# Altium project 100275_NOTECARRIER-F.PrjPCB
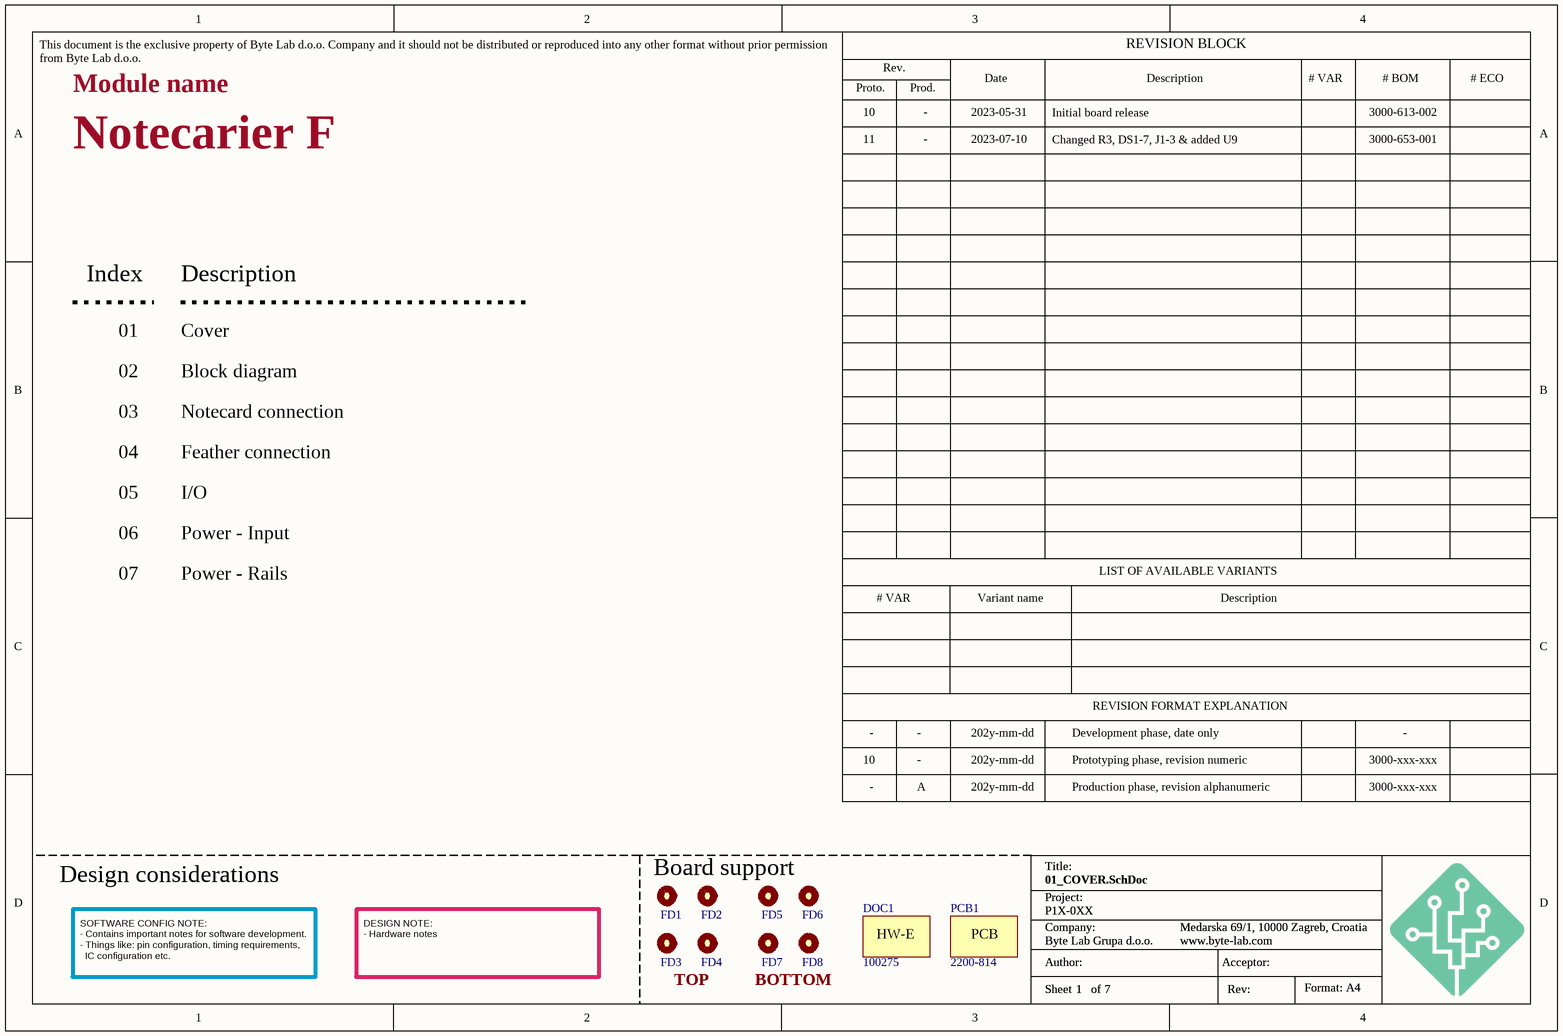
[diagram p0: 01_COVER.SchDoc]
Template_Rev: 25; Sch_Author: M. Hamin; Sch_Acceptor: T. Zvonc; PCBA_BOM_Num: 3000-613-002; PCB_Num: 2200-814; PCB_Author: M. Hamin; PCB_Acceptor: T. Zvonc; Module_Name: Notecarier F; HW_E_Doc_Rev: 11; HW_E_Doc_Num: 100275; FW_Doc_Num: 1xxxxx
7 sheets, 108 parts. Net scope: global (net labels, ports and power ports of the same name join across sheets).
Board files: Notecarier-F.PcbDoc, Notecarier-F_Panel.PcbDoc
Sheets:
  01_COVER.SchDoc
  02_BLOCK-DIAGRAM.SchDoc
  03_NOTECARD-CONNECTION.SchDoc
  04_FEATHER-CONNECTION.SchDoc
  05_IO.SchDoc
  06_POWER-INPUT.SchDoc
  07_POWER-RAILS.SchDoc

## Sheet 01_COVER.SchDoc
size A4; CheckedBy: Inženjer 2; Author: M. Hamin; CompanyName: Byte Lab Grupa d.o.o.; Engineer: Matija Puskar; Organization: Byte Lab Grupa d.o.o.; Address1: Medarska 69/1, 10000 Zagreb, Croatia; DocumentNumber: 1; Revision: 11; SheetNumber: 1; SheetTotal: 7; Web: www.byte-lab.com; Acceptor: T. Zvonc; ProjectName: P1X-0XX

### Parts
DOC1  BL Part Number: 100275  (hidden comment: Electronic design doc number)  (mechanical)
FD1  Fiducial mark  [Fiducial mark 1mm]  (value not drawn)  (no BOM)
FD2  Fiducial mark  [Fiducial mark 1mm]  (value not drawn)  (no BOM)
FD3  Fiducial mark  [Fiducial mark 1mm]  (value not drawn)  (no BOM)
FD4  Fiducial mark  [Fiducial mark 1mm]  (value not drawn)  (no BOM)
FD5  Fiducial mark  [Fiducial mark 1mm]  (value not drawn)  (no BOM)
FD6  Fiducial mark  [Fiducial mark 1mm]  (value not drawn)  (no BOM)
FD7  Fiducial mark  [Fiducial mark 1mm]  (value not drawn)  (no BOM)
FD8  Fiducial mark  [Fiducial mark 1mm]  (value not drawn)  (no BOM)
PCB1  BL Part Number: 2200-814  (hidden comment: PCB Part Number)  (mechanical)

### Nets

Not connected (* = marked no-connect by the designer): FD1 1; FD2 1; FD3 1; FD4 1; FD5 1; FD6 1; FD7 1; FD8 1

### Notes on the sheet
- Module name
- 10
- -
- 2023-05-31
- 3000-613-002
- 11
- 2023-07-10
- Initial board release
- Changed R3, DS1-7, J1-3 & added U9
- 3000-653-001
- Index
- Description
- 01
- 02
- Cover
- Block diagram
- 03
- Notecard connection
- 04
- 05
- Feather connection
- I/O
- 06
- 07
- Power - Input
- Power - Rails
- Design considerations
- Board support
- SOFTWARE CONFIG NOTE:
  - Contains important notes for software development.
  - Things like: pin configuration, timing requirements,
  IC configuration etc.
- DESIGN NOTE:
  - Hardware notes
- TOP
- BOTTOM
- This document is the exclusive property of Byte Lab d.o.o. Company and it should not be distributed or reproduced into any other format without prior permission
- from Byte Lab d.o.o.
- Proto.
- Rev.
- Prod.
- Date
- REVISION BLOCK
- # VAR
- # BOM
- # ECO
- LIST OF AVAILABLE VARIANTS
- Variant name
- REVISION FORMAT EXPLANATION
- A
- 202y-mm-dd
- Development phase, date only
- Prototyping phase, revision numeric
- Production phase, revision alphanumeric
- 3000-xxx-xxx
- Project:
- Title:
- Author:
- Company:
- Acceptor:
- Format: A4
- Sheet
- of
- Rev:
- (in symbol PN_HW-E) HW-E
- (in symbol PN_PCB) PCB

### Library data of the parts
DOC1 = PN_HW-E: Manufacturer: Byte Lab; Checked_By: Zvonc; Drawn_By: Dodig; Manufacturer Part Number: *; DateModified: *; Note: *
FD1-FD8 = Fiducial mark: Drawn_By: Puskar; Checked_By: Dodig; BL Part Number: N/A; Note: *; Manufacturer: N/A; Manufacturer Part Number: N/A; DateModified: 17-06-2013
PCB1 = PN_PCB: Manufacturer: Byte Lab; Checked_By: Zvonc; Drawn_By: Dodig; Manufacturer Part Number: *; DateModified: *; Note: *

## Sheet 02_BLOCK-DIAGRAM.SchDoc
size A4; CheckedBy: Inženjer 2; Author: M. Hamin; CompanyName: Byte Lab Grupa d.o.o.; Engineer: Matija Puskar; Organization: Byte Lab Grupa d.o.o.; Address1: Medarska 69/1, 10000 Zagreb, Croatia; DocumentNumber: 1; Revision: 11; SheetNumber: 2; SheetTotal: 7; Web: www.byte-lab.com; Acceptor: T. Zvonc; ProjectName: P1X-0XX
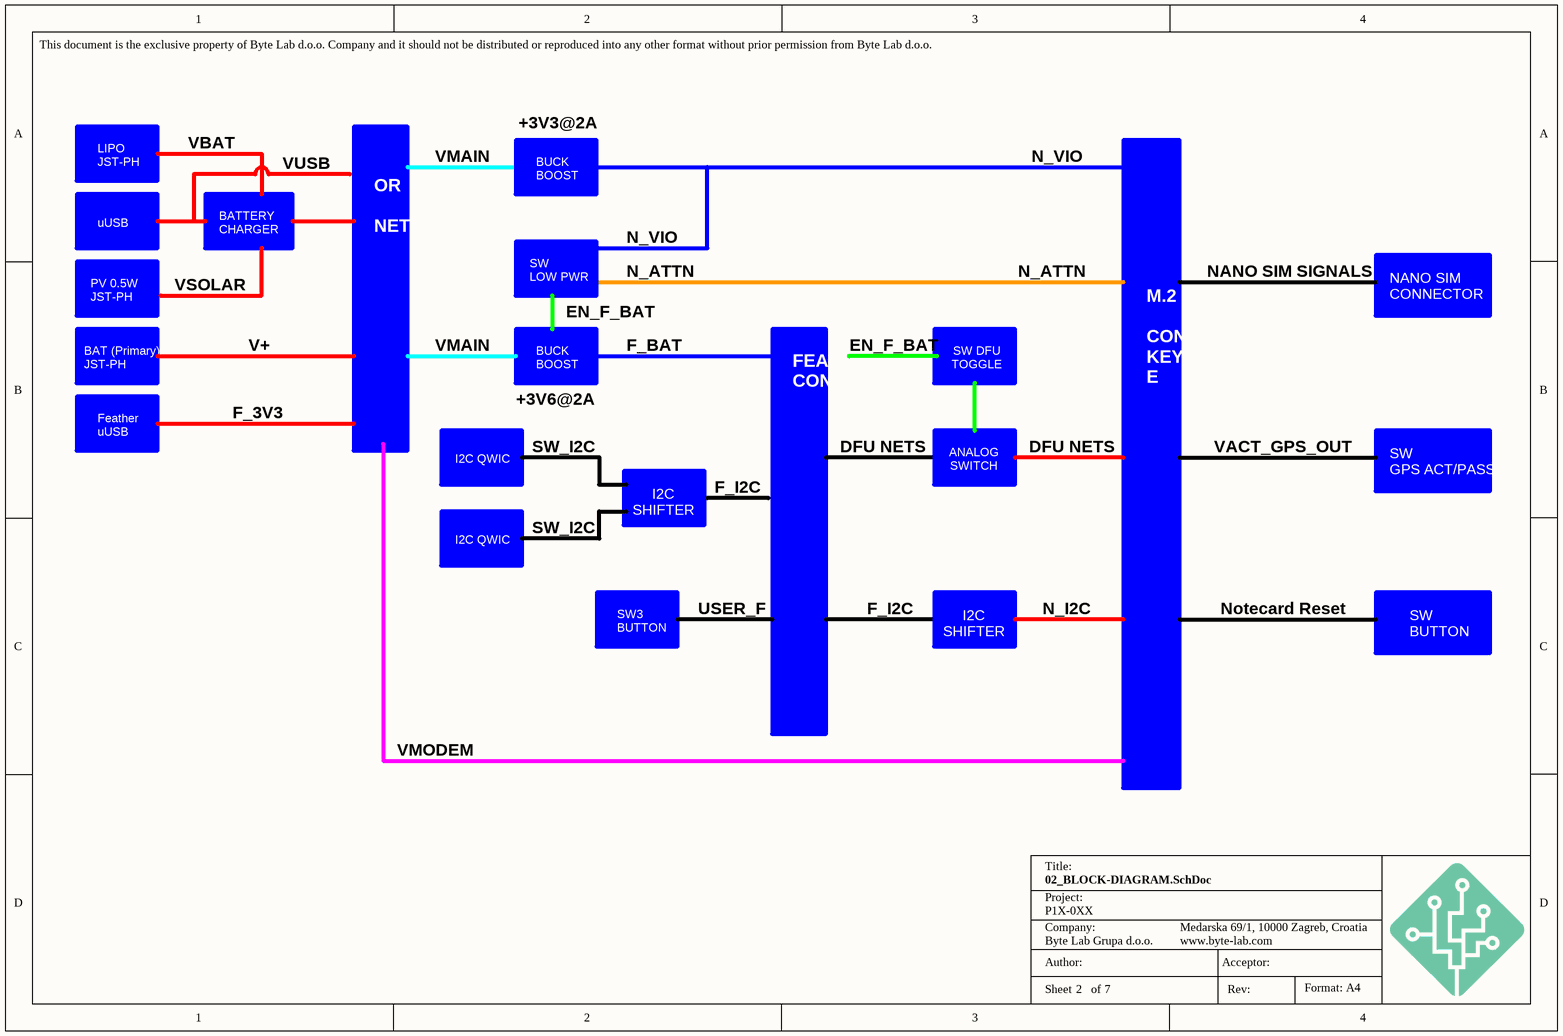
[diagram p1: 02_BLOCK-DIAGRAM.SchDoc]

### Notes on the sheet
- VBAT
- VUSB
- VMAIN
- +3V3@2A
- N_VIO
- uUSB
- LIPO
  JST-PH
- BUCK
  BOOST
- PV 0.5W
  JST-PH
- VSOLAR
- BATTERY
  CHARGER
- SW
  LOW PWR
- N_ATTN
- NANO SIM SIGNALS
- V+
- EN_F_BAT
- F_BAT
- SW DFU
  TOGGLE
- NANO SIM
  CONNECTOR
- BAT (Primary)
  JST-PH
- F_3V3
- OR
  NETWORKT
- +3V6@2A
- Feather
  uUSB
- I2C QWIC
- SW_I2C
- F_I2C
- DFU NETS
- ANALOG
  SWITCH
- VACT_GPS_OUT
- SW
  GPS ACT/PASS
- I2C
  SHIFTER
- SW3 BUTTON
- USER_F
- N_I2C
- Notecard Reset
- SW
  BUTTON
- FEATHER   CONNECTOR
- M.2
  CONNECTOR KEY E
- VMODEM
- This document is the exclusive property of Byte Lab d.o.o. Company and it should not be distributed or reproduced into any other format without prior permission from Byte Lab d.o.o.
- Project:
- Title:
- Author:
- Company:
- Acceptor:
- Format: A4
- Sheet
- of
- Rev:

## Sheet 03_NOTECARD-CONNECTION.SchDoc
size A4; CheckedBy: Inženjer 2; Author: M. Hamin; CompanyName: Byte Lab Grupa d.o.o.; Engineer: Matija Puskar; Organization: Byte Lab Grupa d.o.o.; Address1: Medarska 69/1, 10000 Zagreb, Croatia; DocumentNumber: 1; Revision: 11; SheetNumber: 3; SheetTotal: 7; Web: www.byte-lab.com; Acceptor: T. Zvonc; ProjectName: P1X-0XX
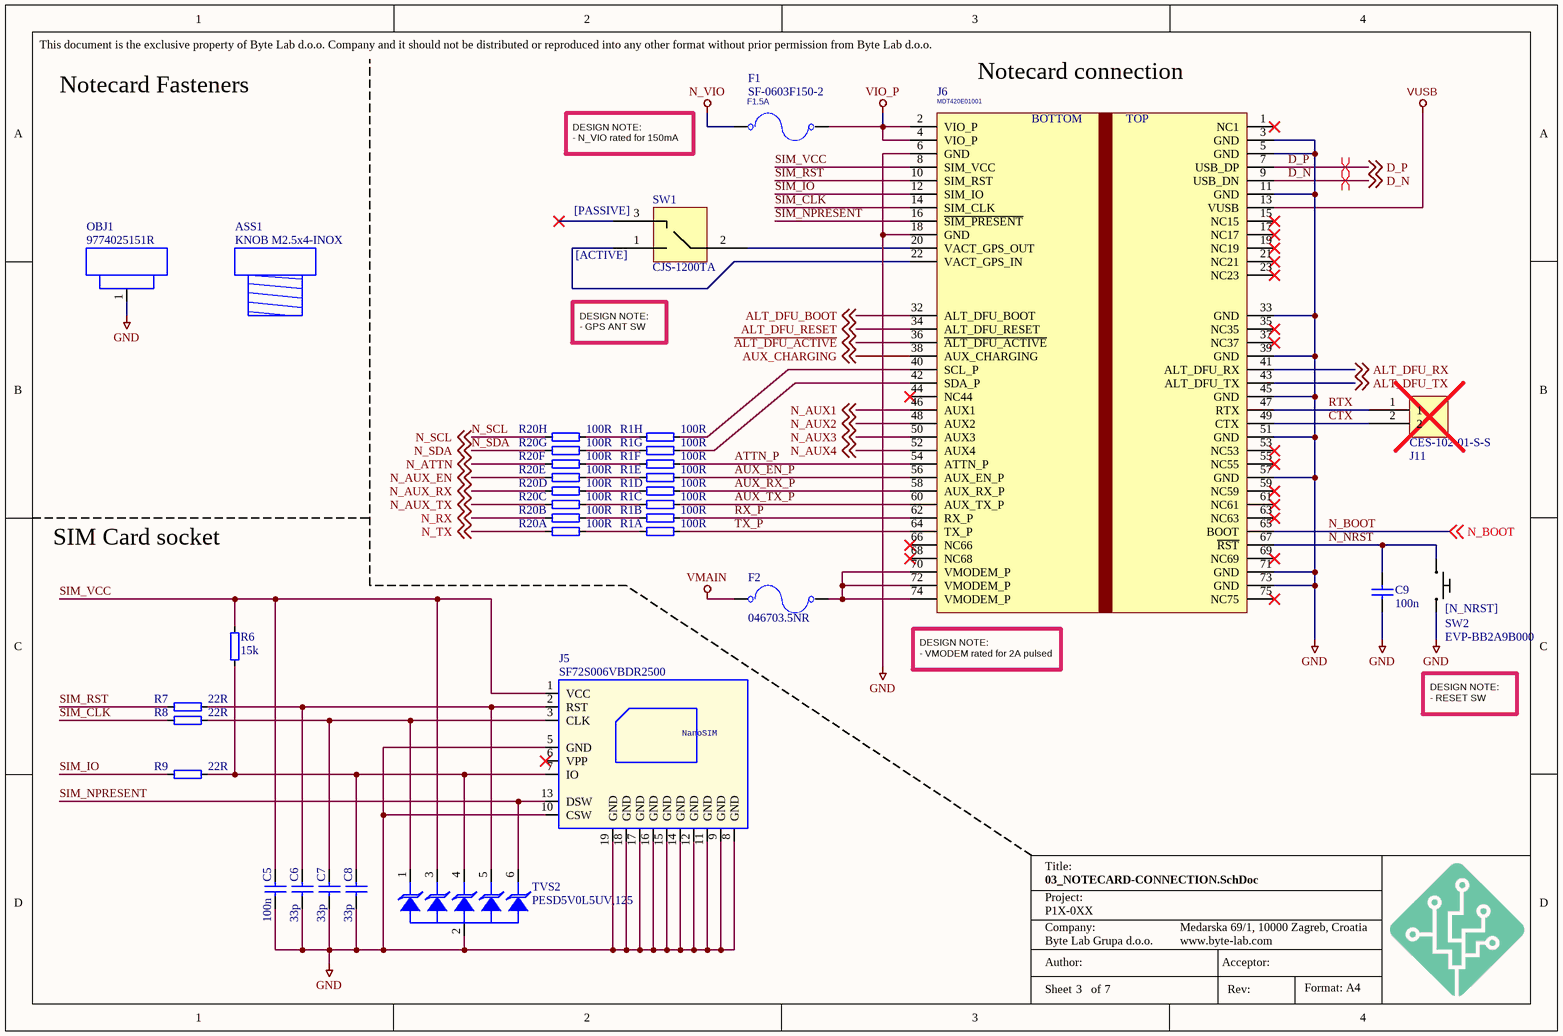
[diagram p2: 03_NOTECARD-CONNECTION.SchDoc]

### Parts
ASS1  KNOB M2.5x4-INOX  (mechanical)
C5  100n  [C-0402]
C6  33p  [C-0402]
C7  33p  [C-0402]
C8  33p  [C-0402]
C9  100n  [C-0402]
F1  SF-0603F150-2  [FS-0603]
F2  046703.5NR  [FS-0603]
J5  SF72S006VBDR2500  [J-NANOSIM-SF72S006VBA]
J6  MDT420E01001  [J-75-0050-MOS-M2]
J11  CES-102-01-S-S  [CONN_02]  (no BOM)
OBJ1  9774025151R  [DIST-WASMSIM0250]
R1  100R  [RESCAXS80P640X160X50-16N]  (parts A,B,C,D,E,F,G,H of 8)
R6  15k  [R-0402]
R7  22R  [R-0402]
R8  22R  [R-0402]
R9  22R  [R-0402]
R20  100R  [RESCAXS80P640X160X50-16N]  (parts A,B,C,D,E,F,G,H of 8)
SW1  CJS-1200TA  [SW_CJS-1200TA]
SW2  EVP-BB2A9B000  [SW_EVP-BB2A9B000]
TVS2  PESD5V0L5UV,125  [SOT666]

### Nets
GND: C5.1 C6.1 C7.1 C8.1 C9.1 J5.5(GND) J5.8(GND) J5.9(GND) J5.10(CSW) J5.11(GND) J5.12(GND) J5.14(GND) J5.15(GND) J5.16(GND) J5.17(GND) J5.18(GND) J5.19(GND) J6.3(GND) J6.5(GND) J6.6(GND) J6.11(GND) J6.18(GND) J6.33(GND) J6.39(GND) J6.45(GND) J6.51(GND) J6.57(GND) J6.71(GND) J6.73(GND) OBJ1.1 SW2.2(B) TVS2.2(A2)
N_VIO: F1.1
VIO_P: F1.2 J6.2(VIO_P) J6.4(VIO_P)
VMAIN: F2.1
VUSB: J6.13(VUSB)
~{ALT_DFU_ACTIVE}: J6.36(~{ALT_DFU_ACTIVE}) ; off-sheet ~{ALT_DFU_ACTIVE}
ALT_DFU_BOOT: J6.32(ALT_DFU_BOOT) ; off-sheet ALT_DFU_BOOT
ALT_DFU_RESET: J6.34(ALT_DFU_RESET) ; off-sheet ALT_DFU_RESET
ALT_DFU_RX: J6.41(ALT_DFU_RX) ; off-sheet ALT_DFU_RX
ALT_DFU_TX: J6.43(ALT_DFU_TX) ; off-sheet ALT_DFU_TX
ATTN_P: J6.54(ATTN_P) R1.11
AUX_CHARGING: J6.38(AUX_CHARGING) ; off-sheet AUX_CHARGING
AUX_EN_P: J6.56(AUX_EN_P) R1.12
AUX_RX_P: J6.58(AUX_RX_P) R1.13
AUX_TX_P: J6.60(AUX_TX_P) R1.14
CTX: J6.49(CTX) J11.2
D_N: J6.9(USB_DN) ; off-sheet D_N
D_P: J6.7(USB_DP) ; off-sheet D_P
N_ATTN: R20.6 ; off-sheet N_ATTN
N_AUX1: J6.46(AUX1) ; off-sheet N_AUX1
N_AUX2: J6.48(AUX2) ; off-sheet N_AUX2
N_AUX3: J6.50(AUX3) ; off-sheet N_AUX3
N_AUX4: J6.52(AUX4) ; off-sheet N_AUX4
N_AUX_EN: R20.5 ; off-sheet N_AUX_EN
N_AUX_RX: R20.4 ; off-sheet N_AUX_RX
N_AUX_TX: R20.3 ; off-sheet N_AUX_TX
N_BOOT: J6.65(BOOT) ; off-sheet N_BOOT
N_NRST: C9.2 J6.67(~{RST}) SW2.1(A)
N_RX: R20.2 ; off-sheet N_RX
N_SCL: R20.8 ; off-sheet N_SCL
N_SDA: R20.7 ; off-sheet N_SDA
N_TX: R20.1 ; off-sheet N_TX
RTX: J6.47(RTX) J11.1
RX_P: J6.62(RX_P) R1.15
SIM_CLK: J6.14(SIM_CLK) R8.1
SIM_IO: J6.12(SIM_IO) R9.1
SIM_NPRESENT: J5.13(DSW) J6.16(~{SIM_PRESENT}) TVS2.6(C6)
SIM_RST: J6.10(SIM_RST) R7.1
SIM_VCC: C5.2 J5.1(VCC) J6.8(SIM_VCC) R6.2 TVS2.3(C3)
TX_P: J6.64(TX_P) R1.16
NetC6_2: C6.2 J5.2(RST) R7.2 TVS2.5(A5)
NetC7_2: C7.2 J5.3(CLK) R8.2 TVS2.1(C1)
NetC8_2: C8.2 J5.7(IO) R6.1 R9.2 TVS2.4(C4)
NetF2_2: F2.2 J6.70(VMODEM_P) J6.72(VMODEM_P) J6.74(VMODEM_P)
NetJ6_20: J6.20(VACT_GPS_OUT) SW1.2
NetJ6_22: J6.22(VACT_GPS_IN) SW1.1
NetJ6_40: J6.40(SCL_P) R1.9
NetJ6_42: J6.42(SDA_P) R1.10
NetR1_1: R1.1 R20.16
NetR1_2: R1.2 R20.15
NetR1_3: R1.3 R20.14
NetR1_4: R1.4 R20.13
NetR1_5: R1.5 R20.12
NetR1_6: R1.6 R20.11
NetR1_7: R1.7 R20.10
NetR1_8: R1.8 R20.9

Not connected (* = marked no-connect by the designer): J5 6(VPP)*; J6 1(NC1)* 15(NC15)* 17(NC17)* 19(NC19)* 21(NC21)* 23(NC23)* 35(NC35)* 37(NC37)* 44(NC44)* 53(NC53)* 55(NC55)* 59(NC59)* 61(NC61)* 63(NC63)* 66(NC66)* 68(NC68)* 69(NC69)* 75(NC75)*; SW1 3*

### Layout directives
differential pair: D_N, D_P

### Notes on the sheet
- Notecard Fasteners
- (near J6) Notecard connection
- DESIGN NOTE:
  - N_VIO rated for 150mA
- (near SW1) [PASSIVE]
- (near SW1) [ACTIVE]
- DESIGN NOTE:
  - GPS ANT SW
- SIM Card socket
- (near SW2) [N_NRST]
- (near J6) DESIGN NOTE:
  - VMODEM rated for 2A pulsed
- DESIGN NOTE:
  - RESET SW
- This document is the exclusive property of Byte Lab d.o.o. Company and it should not be distributed or reproduced into any other format without prior permission from Byte Lab d.o.o.
- Project:
- Title:
- Author:
- Company:
- Acceptor:
- Format: A4
- Sheet
- of
- Rev:
- (in symbol AMPHENOL-75 - M-2 KEY E_13) BOTTOM; TOP
- (in symbol NANOSIM - J-NANOSIM-SF72S006VBA) NanoSIM
- (in symbol RAPIDO - SF-0603F150-2-1.5A/32V) F1.5A

### Library data of the parts
ASS1 = KNOB - M2.5x4-INOX: VITE TCEI 2.5X4 ESAGONO INCASSATO A2 INOX; Manufacturer Part Number: M2.5X4/D7985-A2; Manufacturer: KRAFTBERG; BL Part Number: 6000-168; Drawn_By: Blues Wireless; Supplier Part Number 1: M2.5X4/D7985-A2; Supplier 1: TME
C5 C9 = C0402-100n-16V-X7R: Capacitor ceramic 100n ±10% X7R 16V 0402; BL Part Number: 2000-908; Drawn_By: Puskar; Checked_By: Dodig; Manufacturer: N/A; Supplier 1: Digi-Key; Supplier Part Number 1: 490-3261-1-ND; Note: *; Manufacturer Part Number: N/A; DateModified: 27-08-2013
C6-C8 = C0402-33p-50V-C0G-5: Capacitor ceramic 33p ±5% C0G 50V 0402; BL Part Number: 2001-377; Drawn_By: Puskar; Checked_By: Dodig; Manufacturer: N/A; Supplier 1: Digi-Key; Supplier Part Number 1: 1276-1272-1-ND; Note: *; Manufacturer Part Number: N/A; DateModified: 24-11-2013
F1 = RAPIDO - SF-0603F150-2-1.5A/32V: FUSIBILE RAPIDO 1.5A 32V 0603 SF-0603F150-2 BOURNS SMT; Manufacturer: Bourns Inc.; BL Part Number: 2007-468; Drawn_By: Blues Wireless; Manufacturer Part Number: SF-0603F150-2; Supplier Part Number 1: SF-0603F150-2CT-ND; Supplier 1: Digi-Key
F2 = 046703.5NR: Fuse Chip Very Fast Acting 3.5A 32V SMD Solder Pad 0603 T/R CSA; Manufacturer: Littelfuse Inc.; BL Part Number: 2007-469; Drawn_By: Blues Wireless; Supplier 1: Digi-Key; Supplier Part Number 1: F1400CT-ND; Manufacturer Part Number: 046703.5NR
J5 = NANOSIM - J-NANOSIM-SF72S006VBA: CONN. NANOSIM 8P F/90° PUSH-PUSH SF72S006VBAR2500 JAE ELECTRONICS SMT; BL Part Number: 2007-458; Drawn_By: Blues Wireless; Supplier 1: Digi-Key; Supplier Part Number 1: 670-2967-1-ND; Manufacturer Part Number: SF72S006VBDR2500; Manufacturer: JAE Electronics
J6 = AMPHENOL-75 - M-2 KEY E_13: CONN. M.2 75P M/90° P=0.5 MDT420E01001 AMPHENOL SMT; Manufacturer: Amphenol ICC (FCI); Manufacturer Part Number: MDT420E03001; BL Part Number: 2007-460; Drawn_By: Blues Wireless; Supplier 1: Digi-Key; Supplier Part Number 1: MDT420E03001CT-ND
J11 = CONN_02: 0,1" 2 PIN Header; Manufacturer: Samtec Inc.; BL Part Number: 2007-461; Drawn_By: Blues Wireless; Supplier 1: Digi-Key; Supplier Part Number 1: SAM1085-02-ND; Manufacturer Part Number: CES-102-01-S-S
OBJ1 = DISTANZIALE - M2.5x0250: DISTANZ. CIL. METALLO 5.1X2.5 9774025151R W.E SMT; Manufacturer: Würth Elektronik; BL Part Number: 6020-113; Drawn_By: Blues Wieless; Supplier 1: Digi-Key; Supplier Part Number 1: 732-7078-1-ND; Manufacturer Part Number: 9774025151R
R1 R20 = RESCAXS80P640X160X50-16N - 8x100R: Resistor array 100R 5% 2506; Manufacturer Part Number: 742C163101JP; Manufacturer: CTS Resistor Products; BL Part Number: 2007-472; Drawn_By: Hamin; DateModified: 08-05-2023; Checked_By: *; Note: *; Supplier 1: Digi-Key; Supplier Part Number 1: 742C163101JPCT-ND
R6 = R0402-15k-1: Resistor 15k ±1% 0402; BL Part Number: 2001-157; Checked_By: Zvonc; Drawn_By: Puskar; Supplier 1: Digi-Key; Manufacturer: N/A; Manufacturer Part Number: N/A; Supplier Part Number 1: P15.0KLCT-ND; DateModified: 23-01-2015; Note: *
R7-R9 = R0402-22R-1: Resistor 22R ±1% 0402; BL Part Number: 2001-170; Checked_By: Hamin; Drawn_By: Zvonc; Supplier 1: Digi-Key; Manufacturer: N/A; Manufacturer Part Number: N/A; Supplier Part Number 1: 311-22.0LRCT-ND; DateModified: 13-02-2021; Note: *
SW1 = CJS-1200TA: Switch Slide N.O./N.C. SPDT Raised Slide 0.1A 24VDC J-Hook SMD Embossed T/R; Manufacturer: Nidec Copal; BL Part Number: 2007-456; Drawn_By: Blues Wireless; Supplier 1: Digi-Key; Manufacturer Part Number: CJS-1200TA; Supplier Part Number 1: 563-1021-6-ND
SW2 = Switch tact EVP-BB2A9B000: SWITCH TACTILE SPST-NO 0.05A 15V; Manufacturer: Panasonic Electronic Components; BL Part Number: 2007-124; Drawn_By: Marsic; Manufacturer Part Number: EVP-BB2A9B000; Note: *; DateModified: 09-02-2023; Checked_By: *
TVS2 = PESD5V0L5UV,125: PESD Series 25 W 5 V Uni-Directional Fivefold ESD Protection Diode Array SOT-666; Manufacturer: Nexperia; BL Part Number: 2007-452; Drawn_By: Blues Wireless; Supplier 1: Digi-Key; Manufacturer Part Number: PESD5V0L5UV,125; Supplier Part Number 1: 1727-5797-1-ND

## Sheet 04_FEATHER-CONNECTION.SchDoc
size A4; CheckedBy: Inženjer 2; Author: M. Hamin; CompanyName: Byte Lab Grupa d.o.o.; Engineer: Matija Puskar; Organization: Byte Lab Grupa d.o.o.; Address1: Medarska 69/1, 10000 Zagreb, Croatia; DocumentNumber: 1; Revision: 11; SheetNumber: 4; SheetTotal: 7; Web: www.byte-lab.com; Acceptor: T. Zvonc; ProjectName: P1X-0XX
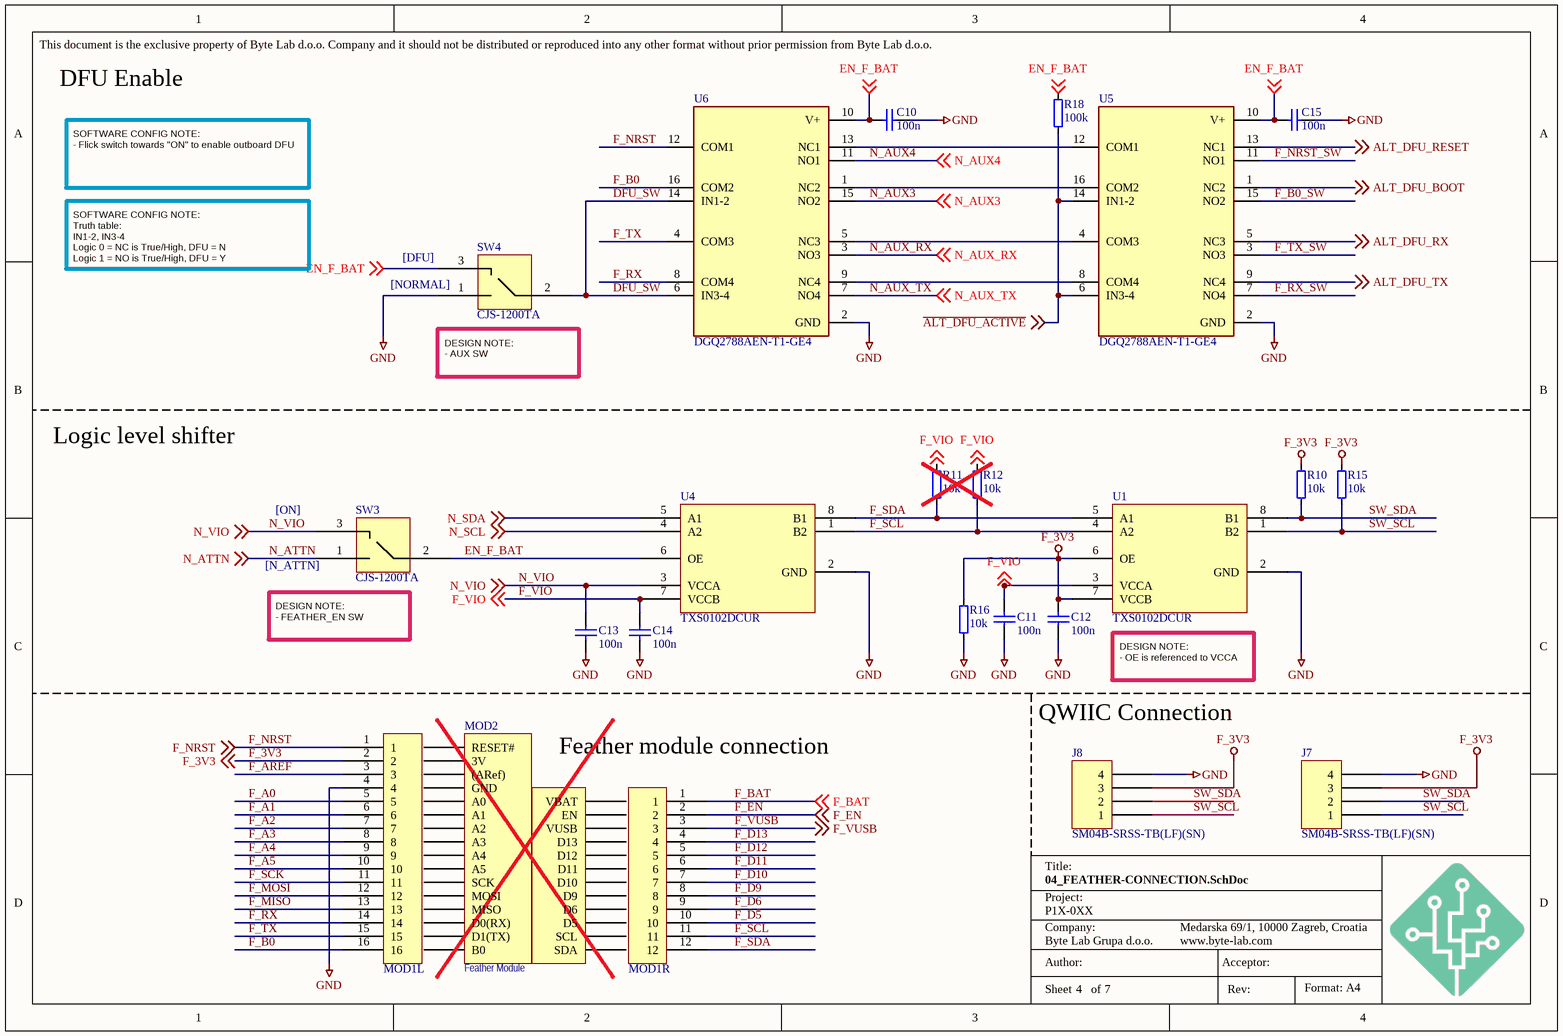
[diagram p3: 04_FEATHER-CONNECTION.SchDoc]

### Parts
C10  100n  [C-0402]
C11  100n  [C-0402]
C12  100n  [C-0402]
C13  100n  [C-0402]
C14  100n  [C-0402]
C15  100n  [C-0402]
J7  SM04B-SRSS-TB(LF)(SN)  [JST SM04B-SRSS-TB]
J8  SM04B-SRSS-TB(LF)(SN)  [JST SM04B-SRSS-TB]
MOD1L  CES-116-01-L-S  [16PIN_254MM]  (value not drawn)
MOD1R  CES-112-01-L-S  [12PIN_254MM]  (value not drawn)
MOD2  Feather Module  [BLUES_WIRELESS_SWAN_2-54_HEADERS]  (no BOM)
R10  10k  [R-0402]
R11  10k  [R-0402]
R12  10k  [R-0402]
R15  10k  [R-0402]
R16  10k  [R-0402]
R18  100k  [R-0402]
SW3  CJS-1200TA  [SW_CJS-1200TA]
SW4  CJS-1200TA  [SW_CJS-1200TA]
U1  TXS0102DCUR  [SOP50P310X90-8N]
U4  TXS0102DCUR  [SOP50P310X90-8N]
U5  DGQ2788AEN-T1-GE4  [QFN40P260X180X60-16N]
U6  DGQ2788AEN-T1-GE4  [QFN40P260X180X60-16N]

### Nets
F_3V3: C12.1 J7.3 J8.3 MOD1L.2 R10.2 R15.2 R16.1 U1.6(OE) U1.7(VCCB) ; off-sheet F_3V3
GND: C10.1 C11.2 C12.2 C13.2 C14.2 C15.1 J7.4 J8.4 MOD1L.4 R16.2 SW4.1 U1.2(GND) U4.2(GND) U5.2(GND) U6.2(GND)
N_VIO: C13.1 SW3.3 U4.3(VCCA) ; off-sheet N_VIO
~{ALT_DFU_ACTIVE}: R18.1 U5.6(IN3-4) U5.14(IN1-2) ; off-sheet ~{ALT_DFU_ACTIVE}
ALT_DFU_BOOT: U5.1(NC2) ; off-sheet ALT_DFU_BOOT
ALT_DFU_RESET: U5.13(NC1) ; off-sheet ALT_DFU_RESET
ALT_DFU_RX: U5.5(NC3) ; off-sheet ALT_DFU_RX
ALT_DFU_TX: U5.9(NC4) ; off-sheet ALT_DFU_TX
DFU_SW: SW4.2 U6.6(IN3-4) U6.14(IN1-2)
EN_F_BAT: C10.2 C15.2 R18.2 SW3.2 SW4.3 U4.6(OE) U5.10(V+) U6.10(V+) ; off-sheet EN_F_BAT
F_A0: MOD1L.5
F_A1: MOD1L.6
F_A2: MOD1L.7
F_A3: MOD1L.8
F_A4: MOD1L.9
F_A5: MOD1L.10
F_AREF: MOD1L.3
F_B0: MOD1L.16 U6.16(COM2)
F_B0_SW: U5.15(NO2)
F_BAT: MOD1R.1 ; off-sheet F_BAT
F_D5: MOD1R.10
F_D6: MOD1R.9
F_D9: MOD1R.8
F_D10: MOD1R.7
F_D11: MOD1R.6
F_D12: MOD1R.5
F_D13: MOD1R.4
F_EN: MOD1R.2 ; off-sheet F_EN
F_MISO: MOD1L.13
F_MOSI: MOD1L.12
F_NRST: MOD1L.1 U6.12(COM1) ; off-sheet F_NRST
F_NRST_SW: U5.11(NO1)
F_RX: MOD1L.14 U6.8(COM4)
F_RX_SW: U5.7(NO4)
F_SCK: MOD1L.11
F_SCL: MOD1R.11 R12.1 U1.4(A2) U4.1(B2)
F_SDA: MOD1R.12 R11.1 U1.5(A1) U4.8(B1)
F_TX: MOD1L.15 U6.4(COM3)
F_TX_SW: U5.3(NO3)
F_VIO: C11.1 C14.1 R11.2 R12.2 U1.3(VCCA) U4.7(VCCB) ; off-sheet F_VIO
F_VUSB: MOD1R.3 ; off-sheet F_VUSB
N_ATTN: SW3.1 ; off-sheet N_ATTN
N_AUX3: U6.15(NO2) ; off-sheet N_AUX3
N_AUX4: U6.11(NO1) ; off-sheet N_AUX4
N_AUX_RX: U6.3(NO3) ; off-sheet N_AUX_RX
N_AUX_TX: U6.7(NO4) ; off-sheet N_AUX_TX
N_SCL: U4.4(A2) ; off-sheet N_SCL
N_SDA: U4.5(A1) ; off-sheet N_SDA
SW_SCL: J7.1 J8.1 R15.1 U1.1(B2)
SW_SDA: J7.2 J8.2 R10.1 U1.8(B1)
NetU5_4: U5.4(COM3) U6.5(NC3)
NetU5_8: U5.8(COM4) U6.9(NC4)
NetU5_12: U5.12(COM1) U6.13(NC1)
NetU5_16: U5.16(COM2) U6.1(NC2)

Not connected (* = marked no-connect by the designer): MOD2 1(RESET#) 2(3V) 3((ARef)) 4(GND) 5(A0) 6(A1) 7(A2) 8(A3) 9(A4) 10(A5) 11(SCK) 12(MOSI) 13(MISO) 14(D0(RX)) 15(D1(TX)) 16(B0) 17(SDA) 18(SCL) 19(D5) 20(D6) 21(D9) 22(D10) 23(D11) 24(D12) 25(D13) 26(VUSB) 27(EN) 28(VBAT)

### Notes on the sheet
- DFU Enable
- SOFTWARE CONFIG NOTE:
  - Flick switch towards "ON" to enable outboard DFU
- SOFTWARE CONFIG NOTE:
  Truth table:
  IN1-2, IN3-4
  Logic 0 = NC is True/High, DFU = N
  Logic 1 = NO is True/High, DFU = Y
- (near SW4) [NORMAL]
- (near SW4) [DFU]
- (near SW4) DESIGN NOTE:
  - AUX SW
- Logic level shifter
- [ON]
- (near SW3) [N_ATTN]
- (near SW3) DESIGN NOTE:
  - FEATHER_EN SW
- DESIGN NOTE:
  - OE is referenced to VCCA
- (near MOD2) Feather module connection
- QWIIC Connection
- This document is the exclusive property of Byte Lab d.o.o. Company and it should not be distributed or reproduced into any other format without prior permission from Byte Lab d.o.o.
- Project:
- Title:
- Author:
- Company:
- Acceptor:
- Format: A4
- Sheet
- of
- Rev:

### Library data of the parts
C10-C15 = C0402-100n-16V-X7R: as C5 on sheet 03_NOTECARD-CONNECTION; Manufacturer: N/A; Supplier 1: Digi-Key; Supplier Part Number 1: 490-3261-1-ND; Note: *; Manufacturer Part Number: N/A; DateModified: 27-08-2013
J7 J8 = SM04B-SRSS-TB(LF)(SN): CONN HEADER SH 4POS SIDE 1MM TIN; Manufacturer: JST Sales America Inc.; BL Part Number: 2002-058; Drawn_By: Blues Wireless; Supplier 1: Digi-Key; Manufacturer Part Number: SM04B-SRSS-TB(LF)(SN); Supplier Part Number 1: 455-1804-1-ND
MOD1L = SOCKET_LFB_16: Socket 16-Pin, 0.100 in; Manufacturer: Samtec Inc.; BL Part Number: 2007-463; Drawn_By: Blues Wireless; Supplier 1: Digi-Key; Supplier Part Number 1: CES-116-01-L-S-ND; Manufacturer Part Number: CES-116-01-L-S
MOD1R = SOCKET_LFB_12: Socket 12-Pin, 0.100 in; Manufacturer: Samtec Inc.; BL Part Number: 2007-464; Drawn_By: Blues Wireless; Supplier 1: Digi-Key; Supplier Part Number 1: 612-CES-112-01-L-S-ND; Manufacturer Part Number: CES-112-01-L-S
MOD2 = ADAFRUIT_FEATHER_COMMON_1: Typical Adafruit Feather Pinout
R10-R12 R15 R16 = R0402-10k-1: Resistor 10k ±1% 0402; BL Part Number: 2000-729; Checked_By: Dodig; Drawn_By: Puskar; Supplier 1: Digi-Key; Manufacturer: N/A; Manufacturer Part Number: N/A; Supplier Part Number 1: 311-10.0KLRCT-ND; DateModified: 27-08-2013; Note: *
R18 = R0402-100k-1: Resistor 100k ±1% 0402; BL Part Number: 2000-727; Checked_By: Dodig; Drawn_By: Puskar; Supplier 1: Digi-Key; Manufacturer: N/A; Manufacturer Part Number: N/A; Supplier Part Number 1: RHM100CDCT-ND; DateModified: 27-10-2013; Note: *
SW3 SW4 = CJS-1200TA: as SW1 on sheet 03_NOTECARD-CONNECTION; Supplier 1: Digi-Key; Manufacturer Part Number: CJS-1200TA; Supplier Part Number 1: 563-1021-6-ND
U1 U4 = TXS0102DCUR: 2-Bit Bidirectional Voltage-Level Shifter for Open-Drain and Push-Pull Application 8-VSSOP -40 to 85; Manufacturer: Texas Instruments; BL Part Number: 2007-455; Drawn_By: Blues Wireless; Supplier 1: Digi-Key; Manufacturer Part Number: TXS0102DCUR; Supplier Part Number 1: 296-21931-6-ND
U5 U6 = DGQ2788AEN-T1-GE4: Analog Switch Quad SPDT Automotive 16-Pin Mini-QFN T/R; Manufacturer: Vishay; BL Part Number: 2007-457; Drawn_By: Blues Wireless; Supplier 1: Digi-Key; Manufacturer Part Number: DGQ2788AEN-T1-GE4; Supplier Part Number 1: DGQ2788AEN-T1-GE4CT-ND

## Sheet 05_IO.SchDoc
size A4; CheckedBy: Inženjer 2; Author: M. Hamin; CompanyName: Byte Lab Grupa d.o.o.; Engineer: Matija Puskar; Organization: Byte Lab Grupa d.o.o.; Address1: Medarska 69/1, 10000 Zagreb, Croatia; DocumentNumber: 1; Revision: 11; SheetNumber: 5; SheetTotal: 7; Web: www.byte-lab.com; Acceptor: T. Zvonc; ProjectName: P1X-0XX
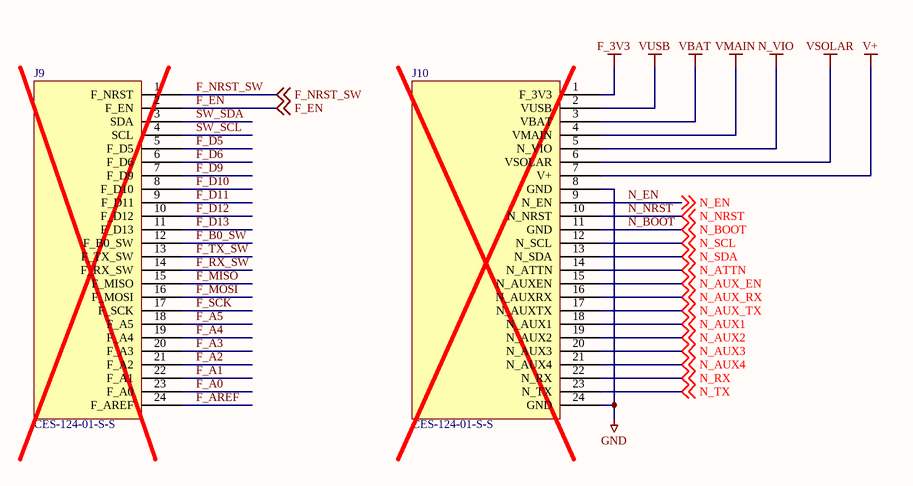
[diagram p4: 05_IO.SchDoc]

### Parts
J9  CES-124-01-S-S  [CES-124-01-S-S]
J10  CES-124-01-S-S  [CES-124-01-S-S]

### Nets
F_3V3: J10.1(F_3V3)
GND: J10.8(GND) J10.24(GND)
N_VIO: J10.5(N_VIO)
V+: J10.7(V+)
VBAT: J10.3(VBAT)
VMAIN: J10.4(VMAIN)
VSOLAR: J10.6(VSOLAR)
VUSB: J10.2(VUSB)
F_A0: J9.23(F_A0)
F_A1: J9.22(F_A1)
F_A2: J9.21(F_A2)
F_A3: J9.20(F_A3)
F_A4: J9.19(F_A4)
F_A5: J9.18(F_A5)
F_AREF: J9.24(F_AREF)
F_B0_SW: J9.12(F_B0_SW)
F_D5: J9.5(F_D5)
F_D6: J9.6(F_D6)
F_D9: J9.7(F_D9)
F_D10: J9.8(F_D10)
F_D11: J9.9(F_D11)
F_D12: J9.10(F_D12)
F_D13: J9.11(F_D13)
F_EN: J9.2(F_EN) ; off-sheet F_EN
F_MISO: J9.15(F_MISO)
F_MOSI: J9.16(F_MOSI)
F_NRST_SW: J9.1(F_NRST) ; off-sheet F_NRST_SW
F_RX_SW: J9.14(F_RX_SW)
F_SCK: J9.17(F_SCK)
F_TX_SW: J9.13(F_TX_SW)
N_ATTN: J10.14(N_ATTN) ; off-sheet N_ATTN
N_AUX1: J10.18(N_AUX1) ; off-sheet N_AUX1
N_AUX2: J10.19(N_AUX2) ; off-sheet N_AUX2
N_AUX3: J10.20(N_AUX3) ; off-sheet N_AUX3
N_AUX4: J10.21(N_AUX4) ; off-sheet N_AUX4
N_AUX_EN: J10.15(N_AUXEN) ; off-sheet N_AUX_EN
N_AUX_RX: J10.16(N_AUXRX) ; off-sheet N_AUX_RX
N_AUX_TX: J10.17(N_AUXTX) ; off-sheet N_AUX_TX
N_BOOT: J10.11(GND) ; off-sheet N_BOOT
N_EN: J10.9(N_EN) ; off-sheet N_EN
N_NRST: J10.10(N_NRST) ; off-sheet N_NRST
N_RX: J10.22(N_RX) ; off-sheet N_RX
N_SCL: J10.12(N_SCL) ; off-sheet N_SCL
N_SDA: J10.13(N_SDA) ; off-sheet N_SDA
N_TX: J10.23(N_TX) ; off-sheet N_TX
SW_SCL: J9.4(SCL)
SW_SDA: J9.3(SDA)

### Notes on the sheet
- This document is the exclusive property of Byte Lab d.o.o. Company and it should not be distributed or reproduced into any other format without prior permission from Byte Lab d.o.o.
- Project:
- Title:
- Author:
- Company:
- Acceptor:
- Format: A4
- Sheet
- of
- Rev:

### Library data of the parts
J9 = SIDECON: 24x1 0.1" pitch half height female header; Manufacturer: Samtec Inc.; BL Part Number: 2007-465; Drawn_By: Blues Wireless; Supplier 1: Digi-Key; Supplier Part Number 1: SAM1085-24-ND; Manufacturer Part Number: CES-124-01-S-S
J10 = SIDECON_N: 24x1 0.1" pitch half height female header; Manufacturer: Samtec Inc.; BL Part Number: 2007-465; Drawn_By: Blues Wireless; Supplier 1: Digi-Key; Supplier Part Number 1: SAM1085-24-ND; Manufacturer Part Number: CES-124-01-S-S

## Sheet 06_POWER-INPUT.SchDoc
size A4; CheckedBy: Inženjer 2; Author: M. Hamin; CompanyName: Byte Lab Grupa d.o.o.; Engineer: Matija Puskar; Organization: Byte Lab Grupa d.o.o.; Address1: Medarska 69/1, 10000 Zagreb, Croatia; DocumentNumber: 1; Revision: 11; SheetNumber: 6; SheetTotal: 7; Web: www.byte-lab.com; Acceptor: T. Zvonc; ProjectName: P1X-0XX
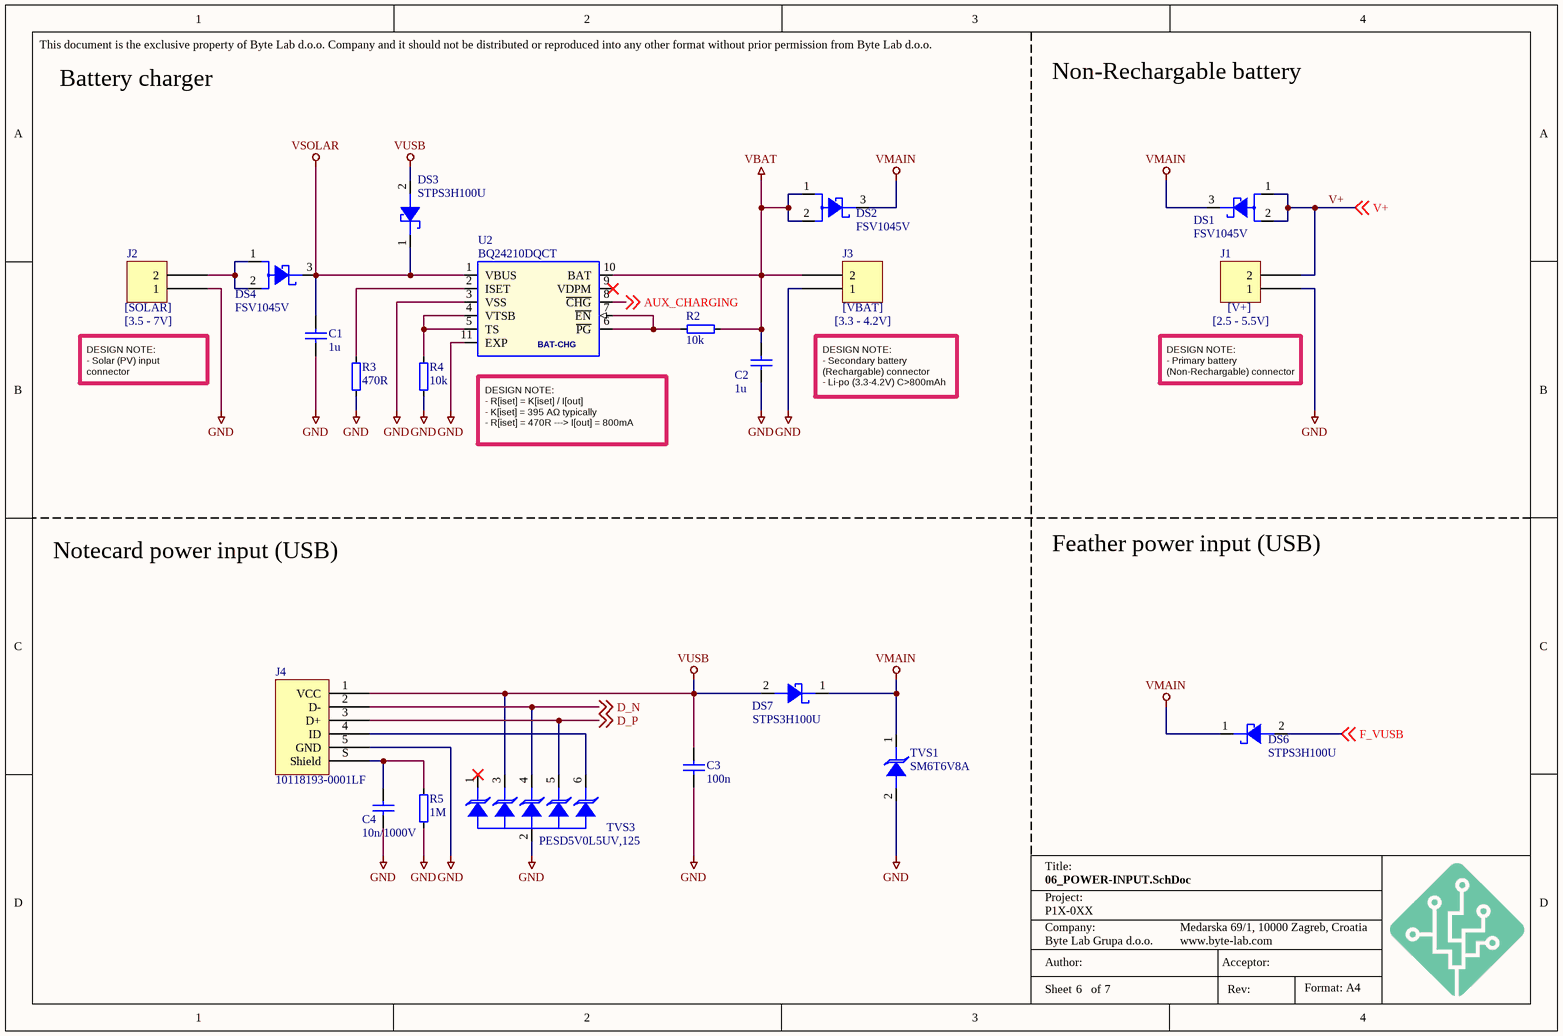
[diagram p5: 06_POWER-INPUT.SchDoc]

### Parts
C1  1u  [C-0603]
C2  1u  [C-0603]
C3  100n  [C-0402]
C4  10n/1000V  [C-1206]
DS1  FSV1045V  [TO277-3]
DS2  FSV1045V  [TO277-3]
DS3  STPS3H100U  [SMB]
DS4  FSV1045V  [TO277-3]
DS6  STPS3H100U  [SMB]
DS7  STPS3H100U  [SMB]
J1  S2BPHSM4TBLFSN  [JST S2B-PH-SM4-TB]  (value not drawn)
J2  S2BPHSM4TBLFSN  [JST S2B-PH-SM4-TB]  (value not drawn)
J3  S2BPHSM4TBLFSN  [JST S2B-PH-SM4-TB]  (value not drawn)
J4  10118193-0001LF  [FCI USB 10118193-0001LF]
R2  10k  [R-0402]
R3  470R  [R-0402]
R4  10k  [R-0402]
R5  1M  [R-1206]
TVS1  SM6T6V8A  [SMB]
TVS3  PESD5V0L5UV,125  [SOT666]
U2  BQ24210DQCT  [WSON10-EXP]

### Nets
GND: C1.1 C2.1 C3.2 C4.2 J1.1 J2.1 J3.1 J4.5(GND) R3.1 R4.1 R5.2 TVS1.2(A) TVS3.2(A2) U2.3(VSS) U2.11(EXP)
V+: DS1.1(A1) DS1.2(A2) J1.2 ; off-sheet V+
VBAT: C2.2 DS2.1(A1) DS2.2(A2) J3.2 R2.2 U2.10(BAT)
VMAIN: DS1.3(C) DS2.3(C) DS6.1(C) DS7.1(C) TVS1.1(C)
VSOLAR: C1.2 DS3.1(C) DS4.3(C) U2.1(VBUS)
VUSB: C3.1 DS3.2(A) DS7.2(A) J4.1(VCC) TVS3.3(C3)
AUX_CHARGING: U2.8(~{CHG}) ; off-sheet AUX_CHARGING
D_N: J4.2(D-) TVS3.4(C4) ; off-sheet D_N
D_P: J4.3(D+) TVS3.5(A5) ; off-sheet D_P
F_VUSB: DS6.2(A) ; off-sheet F_VUSB
NetC4_1: C4.1 J4.S(Shield) R5.1
NetDS4_1: DS4.1(A1) DS4.2(A2) J2.2
NetJ4_4: J4.4(ID) TVS3.6(C6)
NetR2_1: R2.1 U2.6(~{PG}) U2.7(~{EN})
NetR3_2: R3.2 U2.2(ISET)
NetR4_2: R4.2 U2.4(VTSB) U2.5(TS)

Not connected (* = marked no-connect by the designer): TVS3 1(C1)*; U2 9(VDPM)*

### Notes on the sheet
- Battery charger
- Non-Rechargable battery
- (near J2) [SOLAR]
- (near J3) [VBAT]
- (near J1) [V+]
- DESIGN NOTE:
  - Solar (PV) input connector
- (near J2) [3.5 - 7V]
- DESIGN NOTE:
  - Secondary battery (Rechargable) connector
  - Li-po (3.3-4.2V) C>800mAh
- (near J3) [3.3 - 4.2V]
- DESIGN NOTE:
  - Primary battery (Non-Rechargable) connector
- (near J1) [2.5 - 5.5V]
- DESIGN NOTE:
  - R[iset] = K[iset] / I[out]
  - K[iset] = 395 AΩ typically
  - R[iset] = 470R ---> I[out] = 800mA
- Notecard power input (USB)
- Feather power input (USB)
- This document is the exclusive property of Byte Lab d.o.o. Company and it should not be distributed or reproduced into any other format without prior permission from Byte Lab d.o.o.
- Project:
- Title:
- Author:
- Company:
- Acceptor:
- Format: A4
- Sheet
- of
- Rev:
- (in symbol BAT-CHARGE - BQ24210DQCT) BAT-CHG

### Library data of the parts
C1 C2 = C0603-1u-25V-X5R: Capacitor ceramic 1u ±10% X5R 25V; Manufacturer: Yageo; BL Part Number: 2006-223; Manufacturer Part Number: CC0603KRX5R8BB105; Drawn_By: Hamin; Checked_By: Golubic; Supplier 1: Digi-Key; Supplier Part Number 1: 311-1445-1-ND; Note: *; DateModified: 2022-10-07
C3 = C0402-100n-16V-X7R: as C5 on sheet 03_NOTECARD-CONNECTION; Manufacturer: N/A; Supplier 1: Digi-Key; Supplier Part Number 1: 490-3261-1-ND; Note: *; Manufacturer Part Number: N/A; DateModified: 27-08-2013
C4 = C1206-10n-1000V-X7R - CS1206KKX7RCBB103: Capacitor ceramic 10n ±10% X7R 1000V 1206; Manufacturer: YAGEO; BL Part Number: 2007-449; Drawn_By: Hamin; Supplier 1: Digi-Key; Supplier Part Number 1: 311-3578-1-ND; Note: *; Manufacturer Part Number: CS1206KKX7RCBB103; DateModified: 03-05-2023; Checked_By: *
DS1 DS2 DS4 = SCHOTTKY - FSV1045V - 10A/45V: DIODO SCHOTTKY 10A 45V FSV1045V TO277-3 SMT; BL Part Number: 2007-712; Manufacturer: onsemi; Drawn_By: Blues Wireless; Supplier 1: Digi-Key; Supplier Part Number 1: FSV1045VCT-ND; Manufacturer Part Number: FSV1045V
DS3 DS6 DS7 = SCHOTTKY-STPS3H100U - 3A/100V: DIODO SCHOTTKY 3A 100V STPS3H100U SMB SMT; Manufacturer: STMicroelectronics; BL Part Number: 2007-711; Drawn_By: Blues Wireless; Supplier 1: Digi-Key; Supplier Part Number 1: 497-10392-1-ND; Manufacturer Part Number: STPS3H100U
J1-J3 = S2BPHSM4TBLFSN: PH SMT SIDE ENTRY HDR 2W; Manufacturer: JST; Manufacturer Part Number: S2B-PH-SM4-K-TB (LF)(SN); BL Part Number: 2007-662; Drawn_By: Blues Wireless; Supplier 1: Digi-Key; Supplier Part Number 1: *
J4 = USB 2.0 Type B Micro: CONN RCPT USB2.0 MICRO B SMD R/A; Manufacturer: Amphenol ICC (FCI); BL Part Number: 2007-454; Supplier 1: Digi-Key; Supplier Part Number 1: 609-4616-2-ND; Manufacturer Part Number: 10118193-0001LF
R2 R4 = R0402-10k-1: as R10 on sheet 04_FEATHER-CONNECTION; Supplier 1: Digi-Key; Manufacturer: N/A; Manufacturer Part Number: N/A; Supplier Part Number 1: 311-10.0KLRCT-ND; DateModified: 27-08-2013; Note: *
R3 = R0402-470R-1: Resistor 470R ±1% 0402; BL Part Number: 2001-420; Drawn_By: Hamin; Supplier 1: Digi-Key; Manufacturer: N/A; Manufacturer Part Number: N/A; Supplier Part Number 1: 13-RC0402FR-13470RLCT-ND; DateModified: 10-07-2023; Checked_By: *; Note: *
R5 = R1206-1M-1: Resistor 1M ±1% 1206; BL Part Number: 2001-438; Checked_By: Golubic; Drawn_By: Zvonc; Supplier 1: *; Manufacturer: N/A; Manufacturer Part Number: N/A; Supplier Part Number 1: *; DateModified: 01-07-2014; Note: *
TVS1 = TVS-UNI - SM6T6V8A - 6.8V/600W: DIODO TVS TRANSIL UNIDIR. 600W 6.8V SM6T6V8A SMB SMT; BL Part Number: 2007-453; Manufacturer: STMicroelectronics; Drawn_By: Blues Wireless; Supplier 1: Digi-Key; Supplier Part Number 1: 497-6501-1-ND; Manufacturer Part Number: SM6T6V8A
TVS3 = PESD5V0L5UV,125: as TVS2 on sheet 03_NOTECARD-CONNECTION; Supplier 1: Digi-Key; Manufacturer Part Number: PESD5V0L5UV,125; Supplier Part Number 1: 1727-5797-1-ND
U2 = BAT-CHARGE - BQ24210DQCT: INTEGRATO BQ24210DQCT WSON10 TEXAS SMT; BL Part Number: 2005-527; Manufacturer: Texas Instruments; Drawn_By: Blues Wireless; Supplier 1: Digi-Key; Supplier Part Number 1: 296-28738-1-ND; Manufacturer Part Number: BQ24210DQCT

## Sheet 07_POWER-RAILS.SchDoc
size A4; CheckedBy: Inženjer 2; Author: M. Hamin; CompanyName: Byte Lab Grupa d.o.o.; Engineer: Matija Puskar; Organization: Byte Lab Grupa d.o.o.; Address1: Medarska 69/1, 10000 Zagreb, Croatia; DocumentNumber: 1; Revision: 11; SheetNumber: 7; SheetTotal: 7; Web: www.byte-lab.com; Acceptor: T. Zvonc; ProjectName: P1X-0XX
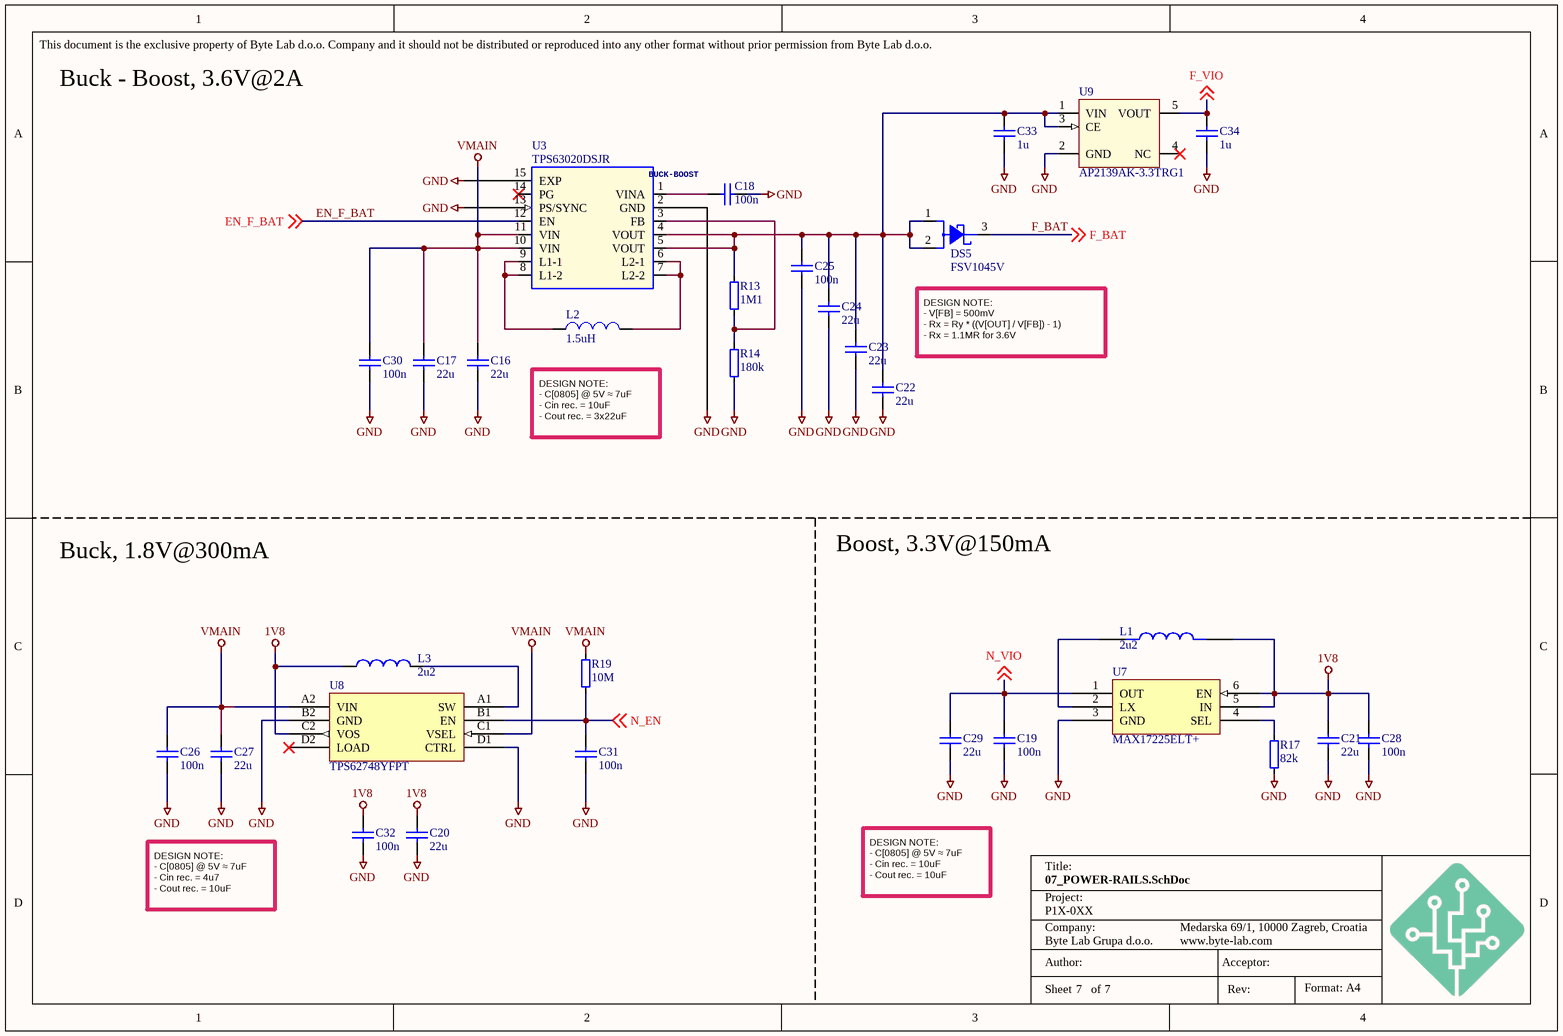
[diagram p6: 07_POWER-RAILS.SchDoc]

### Parts
C16  22u  [C-0805]
C17  22u  [C-0805]
C18  100n  [C-0402]
C19  100n  [C-0402]
C20  22u  [C-0805]
C21  22u  [C-0805]
C22  22u  [C-0805]
C23  22u  [C-0805]
C24  22u  [C-0805]
C25  100n  [C-0402]
C26  100n  [C-0402]
C27  22u  [C-0805]
C28  100n  [C-0402]
C29  22u  [C-0805]
C30  100n  [C-0402]
C31  100n  [C-0402]
C32  100n  [C-0402]
C33  1u  [C-0603]
C34  1u  [C-0603]
DS5  FSV1045V  [TO277-3]
L1  2u2  [IND_XFL4020-222MEC]
L2  1.5uH  [VCHA042A-1R5MS6]
L3  2u2  [1285AS-H-2R2M=P2-INDC2016X100N]
R13  1M1  [R-0402]
R14  180k  [R-0402]
R17  82k  [R-0402]
R19  10M  [R-0402]
U3  TPS63020DSJR  [TI PVSON-14 DSJ]
U7  MAX17225ELT+  [MAX17225ELT+UDFN]
U8  TPS62748YFPT  [TPS62748YFPT-DSBGA4x2]
U9  AP2139AK-3.3TRG1  [SOT-23-5(M5)]

### Nets
1V8: C20.1 C21.2 C28.2 C32.2 L1.2 L3.1 U7.5(IN) U7.6(EN) U8.C2(VOS)
GND: C16.1 C17.1 C18.1 C19.1 C20.2 C21.1 C22.2 C23.2 C24.2 C25.1 C26.1 C27.1 C28.1 C29.2 C30.1 C31.1 C32.1 C33.1 C34.1 R14.1 R17.2 U3.2(GND) U3.13(PS/SYNC) U3.15(EXP) U7.3(GND) U8.B2(GND) U8.D1(CTRL) U9.2(GND)
N_VIO: C19.2 C29.1 U7.1(OUT) ; off-sheet N_VIO
VMAIN: C16.2 C17.2 C26.2 C27.2 C30.2 R19.2 U3.10(VIN) U3.11(VIN) U8.A2(VIN) U8.C1(VSEL)
EN_F_BAT: U3.12(EN) ; off-sheet EN_F_BAT
F_BAT: DS5.3(C) ; off-sheet F_BAT
F_VIO: C34.2 U9.5(VOUT) ; off-sheet F_VIO
N_EN: C31.2 R19.1 U8.B1(EN) ; off-sheet N_EN
NetC18_2: C18.2 U3.1(VINA)
NetC22_1: C22.1 C23.1 C24.1 C25.2 C33.2 DS5.1(A1) DS5.2(A2) R13.2 U3.4(VOUT) U3.5(VOUT) U9.1(VIN) U9.3(CE)
NetL1_1: L1.1 U7.2(LX)
NetL2_1: L2.1(C) U3.6(L2-1) U3.7(L2-2)
NetL2_2: L2.2(A) U3.8(L1-2) U3.9(L1-1)
NetL3_2: L3.2 U8.A1(SW)
NetR13_1: R13.1 R14.2 U3.3(FB)
NetR17_1: R17.1 U7.4(SEL)

Not connected (* = marked no-connect by the designer): U3 14(PG)*; U8 D2(LOAD)*; U9 4(NC)*

### Notes on the sheet
- Buck - Boost, 3.6V@2A
- DESIGN NOTE:
  - V[FB] = 500mV
  - Rx = Ry * ((V[OUT] / V[FB]) - 1)
  - Rx = 1.1MR for 3.6V
- DESIGN NOTE:
  - C[0805] @ 5V ≈ 7uF
  - Cin rec. = 10uF
  - Cout rec. = 3x22uF
- Buck, 1.8V@300mA
- Boost, 3.3V@150mA
- DESIGN NOTE:
  - C[0805] @ 5V ≈ 7uF
  - Cin rec. = 4u7
  - Cout rec. = 10uF
- DESIGN NOTE:
  - C[0805] @ 5V ≈ 7uF
  - Cin rec. = 10uF
  - Cout rec. = 10uF
- This document is the exclusive property of Byte Lab d.o.o. Company and it should not be distributed or reproduced into any other format without prior permission from Byte Lab d.o.o.
- Project:
- Title:
- Author:
- Company:
- Acceptor:
- Format: A4
- Sheet
- of
- Rev:
- (in symbol BUCK-BOOST - TPS63020DSJR) BUCK-BOOST

### Library data of the parts
C16 C17 C20-C24 C27 C29 = C0805-22u-16V-X5R: Capacitor ceramic 22u ±10% X5R 16V 0805; BL Part Number: 2006-222; Drawn_By: Fumic; Checked_By: Hamin; Manufacturer: N/A; Note: *; Manufacturer Part Number: N/A; DateModified: 28-07-2022
C18 C19 C25 C26 C28 C30-C32 = C0402-100n-16V-X7R: as C5 on sheet 03_NOTECARD-CONNECTION; Manufacturer: N/A; Supplier 1: Digi-Key; Supplier Part Number 1: 490-3261-1-ND; Note: *; Manufacturer Part Number: N/A; DateModified: 27-08-2013
C33 C34 = C0603-1u-25V-X5R: as C1 on sheet 06_POWER-INPUT; Supplier 1: Digi-Key; Supplier Part Number 1: 311-1445-1-ND; Note: *; DateModified: 2022-10-07
DS5 = SCHOTTKY - FSV1045V - 10A/45V: as DS1 on sheet 06_POWER-INPUT; Supplier 1: Digi-Key; Supplier Part Number 1: FSV1045VCT-ND; Manufacturer Part Number: FSV1045V
L1 = XFL4020-222MEC: Power Inductors - SMD 2.2Uh Shld 8A 23.5mOhms AECQ2; Manufacturer 1: Coilcraft; BL Part Number: 2007-483; Drawn_By: Blues Wireless; Manufacturer Part Number 1: XFL4020-222MEC; Supplier 1: Mouser; Supplier Part Number 1: 994-XFL4020-222MEC
L2 = VCHA042A-1R5MS6: Fixed Ind 1.5UH 7.3A 15.4 Mohm; Manufacturer: Cyntec; BL Part Number: 2007-451; Drawn_By: Blues Wireless; Supplier 1: Digi-Key; Manufacturer Part Number: VCHA042A-1R5MS6; Supplier Part Number 1: 2037-VCHA042A-1R5MS6CT-ND
L3 = 1285AS-H-2R2M=P2: FIXED IND 2.2UH 1.5A 204MOHM SMD; Manufacturer: Murata Electronics; BL Part Number: 2007-482; Drawn_By: Blues Wireless; Supplier 1: Digi-Key; Manufacturer Part Number: 1285AS-H-2R2M=P2; Supplier Part Number 1: 490-10600-1-ND
R13 = R0402-1M1-1: Resistor 1M1 ±1% 0402; BL Part Number: 2000-730; Drawn_By: Hamin; Supplier 1: Digi-Key; Manufacturer: N/A; Manufacturer Part Number: N/A; Supplier Part Number 1: 13-RC0402FR-071M1LCT-ND; DateModified: 03-05-2023; Checked_By: *; Note: *
R14 = R0402-180k-1: Resistor 180k ±1% 0402; BL Part Number: 2001-422; Checked_By: Hamin; Drawn_By: Dodig; Manufacturer: N/A; Manufacturer Part Number: N/A; DateModified: 15-02-2018; Note: *
R17 = R0402-82k-1: Resistor 82k ±1% 0402; Manufacturer: Yageo; Manufacturer Part Number: RC0402FR-0782KL; BL Part Number: 2001-566; Checked_By: Hamin; Drawn_By: Puskar; Supplier 1: Digi-key; Supplier Part Number 1: 311-82.0KLRCT-ND; DateModified: 20-08-2014; Note: *
R19 = R0402-10M-1: Resistor 10M ±1% 0402; BL Part Number: 2002-832; Checked_By: Dodig; Drawn_By: Zvonc; Supplier 1: Digi-Key; Manufacturer: N/A; Manufacturer Part Number: N/A; Supplier Part Number 1: RC0402FR-0710ML; DateModified: 24-05-2016; Note: *
U3 = BUCK-BOOST - TPS63020DSJR: I.C. DC/DC CONVERTER TPS63020DSJR TEXAS VSON14 SMT; BL Part Number: 2002-405; Manufacturer: Texas Instruments; Drawn_By: Blues Wireless; Supplier 1: Digi-Key; Supplier Part Number 1: 296-36491-1-ND; Manufacturer Part Number: TPS63020DSJR
U7 = MAX17225ELT+: IC REG BOOST ADJ 1A NANO 6UDFN; Manufacturer: Maxim; BL Part Number: 2007-481; Drawn_By: Blues Wireless; Supplier 1: Digi-Key; Manufacturer Part Number: MAX17225ELT+; Supplier Part Number 1: MAX17225ELT+ -ND
U8 = TPS62748YFPT: IC REG BUCK PROG 300MA 8DSBGA; Manufacturer: Texas Instruments; BL Part Number: 2007-480; Drawn_By: Blues Wireless; Supplier 1: Digi-Key; Manufacturer Part Number: TPS62748YFPT; Supplier Part Number 1: 296-43000-1-ND
U9 = AP2139AK-3.3TRG1: IC REG LINEAR 3.3V 250MA SOT23-5; Manufacturer: Diodes Incorporated; BL Part Number: 2006-845; Checked_By: Hlupic; Drawn_By: Marsic; DateModified: 29-09-2022; Manufacturer Part Number: AP2139AK-3.3TRG1; Note: *

## Nets that join several sheets
F_3V3: 04_FEATHER-CONNECTION (9 pins), 05_IO (J10.1)
GND: 03_NOTECARD-CONNECTION (32 pins), 04_FEATHER-CONNECTION (15 pins), 05_IO (J10.8 J10.24), 06_POWER-INPUT (15 pins), 07_POWER-RAILS (28 pins)
N_VIO: 03_NOTECARD-CONNECTION (F1.1), 04_FEATHER-CONNECTION (C13.1 SW3.3 U4.3), 05_IO (J10.5), 07_POWER-RAILS (C19.2 C29.1 U7.1)
V+: 05_IO (J10.7), 06_POWER-INPUT (DS1.1 DS1.2 J1.2)
VBAT: 05_IO (J10.3), 06_POWER-INPUT (6 pins)
VMAIN: 03_NOTECARD-CONNECTION (F2.1), 05_IO (J10.4), 06_POWER-INPUT (5 pins), 07_POWER-RAILS (10 pins)
VSOLAR: 05_IO (J10.6), 06_POWER-INPUT (C1.2 DS3.1 DS4.3 U2.1)
VUSB: 03_NOTECARD-CONNECTION (J6.13), 05_IO (J10.2), 06_POWER-INPUT (5 pins)
~{ALT_DFU_ACTIVE}: 03_NOTECARD-CONNECTION (J6.36), 04_FEATHER-CONNECTION (R18.1 U5.6 U5.14)
ALT_DFU_BOOT: 03_NOTECARD-CONNECTION (J6.32), 04_FEATHER-CONNECTION (U5.1)
ALT_DFU_RESET: 03_NOTECARD-CONNECTION (J6.34), 04_FEATHER-CONNECTION (U5.13)
ALT_DFU_RX: 03_NOTECARD-CONNECTION (J6.41), 04_FEATHER-CONNECTION (U5.5)
ALT_DFU_TX: 03_NOTECARD-CONNECTION (J6.43), 04_FEATHER-CONNECTION (U5.9)
AUX_CHARGING: 03_NOTECARD-CONNECTION (J6.38), 06_POWER-INPUT (U2.8)
D_N: 03_NOTECARD-CONNECTION (J6.9), 06_POWER-INPUT (J4.2 TVS3.4)
D_P: 03_NOTECARD-CONNECTION (J6.7), 06_POWER-INPUT (J4.3 TVS3.5)
EN_F_BAT: 04_FEATHER-CONNECTION (8 pins), 07_POWER-RAILS (U3.12)
F_A0: 04_FEATHER-CONNECTION (MOD1L.5), 05_IO (J9.23)
F_A1: 04_FEATHER-CONNECTION (MOD1L.6), 05_IO (J9.22)
F_A2: 04_FEATHER-CONNECTION (MOD1L.7), 05_IO (J9.21)
F_A3: 04_FEATHER-CONNECTION (MOD1L.8), 05_IO (J9.20)
F_A4: 04_FEATHER-CONNECTION (MOD1L.9), 05_IO (J9.19)
F_A5: 04_FEATHER-CONNECTION (MOD1L.10), 05_IO (J9.18)
F_AREF: 04_FEATHER-CONNECTION (MOD1L.3), 05_IO (J9.24)
F_B0_SW: 04_FEATHER-CONNECTION (U5.15), 05_IO (J9.12)
F_BAT: 04_FEATHER-CONNECTION (MOD1R.1), 07_POWER-RAILS (DS5.3)
F_D5: 04_FEATHER-CONNECTION (MOD1R.10), 05_IO (J9.5)
F_D6: 04_FEATHER-CONNECTION (MOD1R.9), 05_IO (J9.6)
F_D9: 04_FEATHER-CONNECTION (MOD1R.8), 05_IO (J9.7)
F_D10: 04_FEATHER-CONNECTION (MOD1R.7), 05_IO (J9.8)
F_D11: 04_FEATHER-CONNECTION (MOD1R.6), 05_IO (J9.9)
F_D12: 04_FEATHER-CONNECTION (MOD1R.5), 05_IO (J9.10)
F_D13: 04_FEATHER-CONNECTION (MOD1R.4), 05_IO (J9.11)
F_EN: 04_FEATHER-CONNECTION (MOD1R.2), 05_IO (J9.2)
F_MISO: 04_FEATHER-CONNECTION (MOD1L.13), 05_IO (J9.15)
F_MOSI: 04_FEATHER-CONNECTION (MOD1L.12), 05_IO (J9.16)
F_NRST_SW: 04_FEATHER-CONNECTION (U5.11), 05_IO (J9.1)
F_RX_SW: 04_FEATHER-CONNECTION (U5.7), 05_IO (J9.14)
F_SCK: 04_FEATHER-CONNECTION (MOD1L.11), 05_IO (J9.17)
F_TX_SW: 04_FEATHER-CONNECTION (U5.3), 05_IO (J9.13)
F_VIO: 04_FEATHER-CONNECTION (6 pins), 07_POWER-RAILS (C34.2 U9.5)
F_VUSB: 04_FEATHER-CONNECTION (MOD1R.3), 06_POWER-INPUT (DS6.2)
N_ATTN: 03_NOTECARD-CONNECTION (R20.6), 04_FEATHER-CONNECTION (SW3.1), 05_IO (J10.14)
N_AUX1: 03_NOTECARD-CONNECTION (J6.46), 05_IO (J10.18)
N_AUX2: 03_NOTECARD-CONNECTION (J6.48), 05_IO (J10.19)
N_AUX3: 03_NOTECARD-CONNECTION (J6.50), 04_FEATHER-CONNECTION (U6.15), 05_IO (J10.20)
N_AUX4: 03_NOTECARD-CONNECTION (J6.52), 04_FEATHER-CONNECTION (U6.11), 05_IO (J10.21)
N_AUX_EN: 03_NOTECARD-CONNECTION (R20.5), 05_IO (J10.15)
N_AUX_RX: 03_NOTECARD-CONNECTION (R20.4), 04_FEATHER-CONNECTION (U6.3), 05_IO (J10.16)
N_AUX_TX: 03_NOTECARD-CONNECTION (R20.3), 04_FEATHER-CONNECTION (U6.7), 05_IO (J10.17)
N_BOOT: 03_NOTECARD-CONNECTION (J6.65), 05_IO (J10.11)
N_EN: 05_IO (J10.9), 07_POWER-RAILS (C31.2 R19.1 U8.B1)
N_NRST: 03_NOTECARD-CONNECTION (C9.2 J6.67 SW2.1), 05_IO (J10.10)
N_RX: 03_NOTECARD-CONNECTION (R20.2), 05_IO (J10.22)
N_SCL: 03_NOTECARD-CONNECTION (R20.8), 04_FEATHER-CONNECTION (U4.4), 05_IO (J10.12)
N_SDA: 03_NOTECARD-CONNECTION (R20.7), 04_FEATHER-CONNECTION (U4.5), 05_IO (J10.13)
N_TX: 03_NOTECARD-CONNECTION (R20.1), 05_IO (J10.23)
SW_SCL: 04_FEATHER-CONNECTION (J7.1 J8.1 R15.1 U1.1), 05_IO (J9.4)
SW_SDA: 04_FEATHER-CONNECTION (J7.2 J8.2 R10.1 U1.8), 05_IO (J9.3)

## Assembly variants
Production: not fitted J9 J10 J11 MOD2 P1 R11 R12